# Altium schematic sheet hwcb_2.SchDoc
size C; SheetNumber: 2; SheetTotal: 2
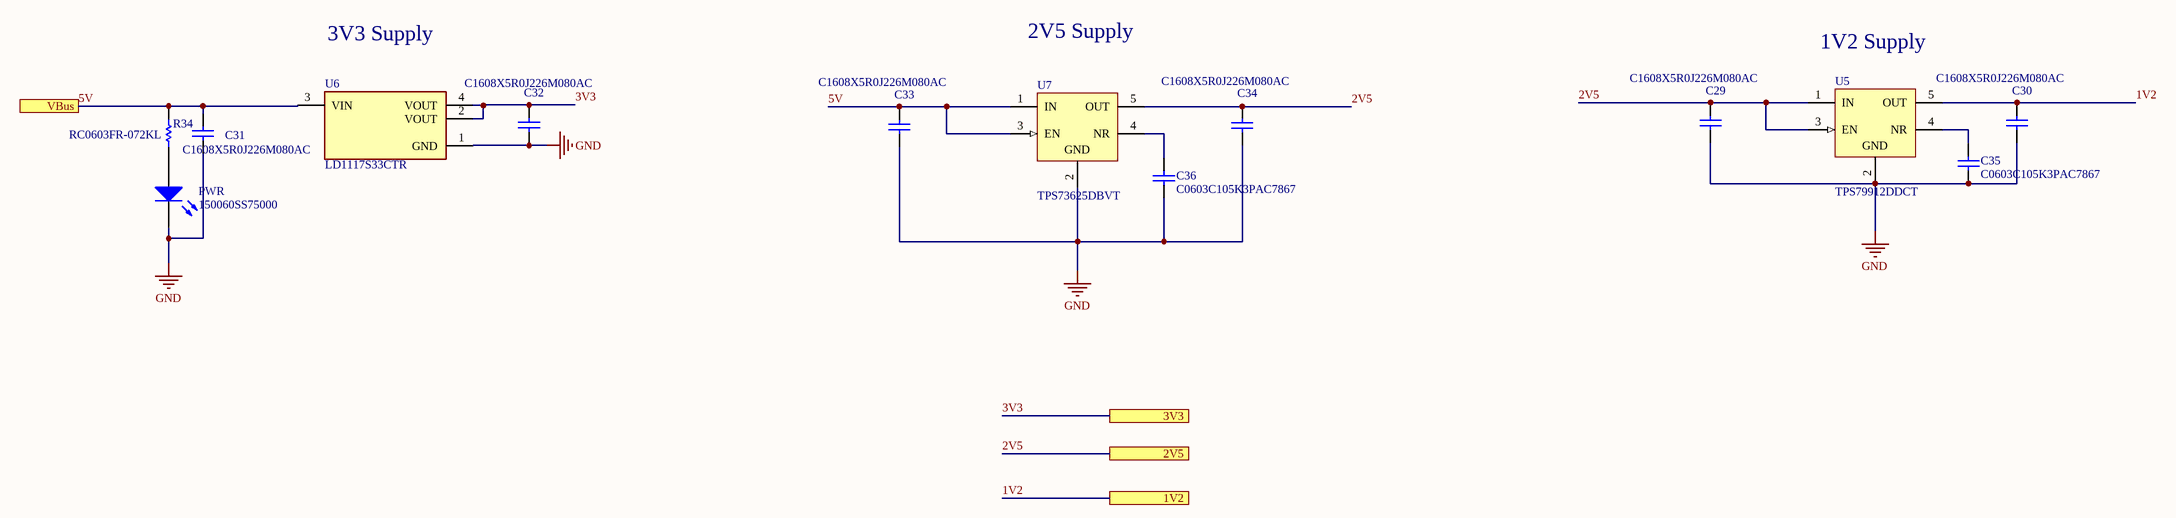
[diagram p0: hwcb_2.SchDoc]

## Parts
C29  C1608X5R0J226M080AC  [CAPC1608X100X20ML10]
C30  C1608X5R0J226M080AC  [CAPC1608X100X20ML10]
C31  C1608X5R0J226M080AC  [CAPC1608X100X20ML10]
C32  C1608X5R0J226M080AC  [CAPC1608X100X20ML10]
C33  C1608X5R0J226M080AC  [CAPC1608X100X20ML10]
C34  C1608X5R0J226M080AC  [CAPC1608X100X20ML10]
C35  C0603C105K3PAC7867  [CAPC1608X90X35LL15T15]
C36  C0603C105K3PAC7867  [CAPC1608X90X35LL15T15]
PWR  150060SS75000  [0603_A]
R34  RC0603FR-072KL  [RESC1608X55X25LL10T15]
U5  TPS79912DDCT  [DDC0005A_L]
U6  LD1117S33CTR  [FP-SOT-223-0046067_14-MFG]
U7  TPS73625DBVT  [DBV0005A_M]

## Ports
1V2, 2V5, 3V3, VBus

## Nets
GND: C29.1 C30.1 C31.1 C32.1 C33.1 C34.1 C35.2 C36.2 PWR.1(K) U5.2(GND) U6.1(GND) U7.2(GND)
1V2: C30.2 U5.5(OUT) ; port 1V2
2V5: C29.2 C34.2 U5.1(IN) U5.3(EN) U7.5(OUT) ; port 2V5
3V3: C32.2 U6.2(VOUT) U6.4(VOUT) ; port 3V3
5V: C31.2 C33.2 R34.1 U6.3(VIN) U7.1(IN) U7.3(EN) ; port VBus
NetC35_1: C35.1 U5.4(NR)
NetC36_1: C36.1 U7.4(NR)
NetPWR_2: PWR.2(A) R34.2

## Notes on the sheet
- 3V3 Supply
- 2V5 Supply
- (near U5) 1V2 Supply

## Library data of the parts
C29-C34 = CMP-2000-05440-1: Chip Capacitor, 22 uF, +/- 20%, 6.3 V, -55 to 85 degC, 1608 (0603 Metric), RoHS, Tape and Reel; PCN Part Number: MLCCPartNumberChange30/Nov/2012; Manufacturer: TDK; Temperature Coefficient: X5R; Product Training Modules: CSeriesGeneralApplicationsSEAT,CCV,andTVCLDesignToolsGuidetoReplacinganElectrolyticCapacitorwithanMLCC; Other Names: 445-8028-1; Capacitance: 22µF; Voltage - Rated: 6.3V; Design Resources: 20WNon-IsolatedBuckLEDDriverUsingPLLNK460KG; Online Catalog: CSeries,GeneralPurpose; Kits: 445-9003-KIT-ND-KITCAPCERHICAPMLCCSMD; Tolerance: ±20%; Series: C; Thickness (Max): 0.039"(1.00mm); Mounting Type: SurfaceMount,MLCC; Ratings: -; Datasheet Version: Mar-15; Package Reference: 603; Packaging: CutTape(CT); Features: -; Package / Case: 0603(1608Metric); Family: CeramicCapacitors; Lead Spacing: -; RoHS Information: RoHSCertificate-MLCC; Manufacturer URL: http://www.tdk.com/; Lead Style: -; Category: Capacitors; Applications: GeneralPurpose; Package Description: 2-Pin Surface Mount Device, Body 1.6 x 0.8 mm; Standard Package: 1; Datasheet URL: http://www.farnell.com/datasheets/1913358.pdf; Height - Seated (Max): -; Operating Temperature: -55degC~85degC; Size / Dimension: 0.063"Lx0.031"W(1.60mmx0.80mm)
C35 C36 = CMP-2006-02216-2: Manufacturer: Kemet; Part Number: C0603C105K3PAC7867
PWR = CMP-1426-00004-1: SMD mono-color Chip LED, WL-SMCW, Super Red; Manufacturer: Wuerth Elektronik; PartNumber: 150060SS75000; ComponentLink2URL: http://katalog.we-online.com/led/datasheet/150060SS75000.pdf; ComponentLink2Description: Datasheet; PackageReference: 0603_A; ComponentLink1Description: Manufacturer URL; ComponentLink1URL: http://www.we-online.com; Color: Super Red
R34 = CMP-2000-06937-1: Chip Resistor, 2 KOhm, +/- 1%, 50 V, -55 to 155 degC, 0603 (1608 Metric), RoHS, Tape and Reel; Manufacturer: Yageo; PCN Other: RC/AC0603/0805/120622/Jan/2013; Resistance (Ohms): 2k; Catalog Drawings: ThickFilmResistorTopThickFilmResistorSide; Kits: PHH4-KIT-ND-RESKIT1K-9.76K1/10W5700PCS; EDA / CAD Models: DownloadfromAcceleratedDesigns; HTML Datasheet: RCSeries,LSuffixDatasheet.html; Power (Watts): 0.1W,1/10W; Other Names: 311-2.00KHRCT; Temperature Coefficient: ±100ppm/°C; Online Catalog: RC0603Series; Features: MoistureResistant; Height: 0.022"(0.55mm); Size / Dimension: 0.063"Lx0.031"W(1.60mmx0.80mm); Product Training Modules: ChipResistor; Mounting Technology: SurfaceMount; Package / Case: 0603(1608Metric); Supplier Device Package: 0603; Category: Resistors; Tolerance: ±1%; Packaging: CutTape(CT); Operating Temperature: -55°C~155°C; Standard Package: 1; Series: RC; Datasheet URL: http://www.yageo.com/documents/recent/PYu-RC_Group_51_RoHS_L_7.pdf; Package Description: 2-Pin Surface Mount Device, Body 1.6 x 0.8 mm; Number of Terminations: 2; Datasheet Version: Rev. 7, 05/2017; Package Reference: 0603; Composition: ThickFilm; Manufacturer URL: http://www.yageo.com/; Family: ChipResistor-SurfaceMount
U5 = CMP-0394-01099-2: Single Output High PSRR LDO, 200 mA, Fixed 1.2 V Output, 2.7 to 6.5 V Input, with Low IQ, 5-pin SOT (DDC), -40 to 125 degC, Green (RoHS & no Sb/Br); Manufacturer: Texas Instruments; Iq(Typ)(mA): 0.04; Vin(Min)(V): 2.7; Rating: Catalog; Vdo(Typ)(mV): 100; Vin(Max)(V): 6.5; Iout(Max)(A): 0.2; Vout Adj(Min)(V): 1.2; SubFamily: Single Channel LDO; Accuracy(%): 2; Mounting Technology: Surface Mount; Eco-Plan: Green (RoHS & no Sb/Br); ComponentLink3URL: http://www.ti.com/litv/pdf/mpds123d; PartNumber: TPS79912DDCT; PackageReference: DDC0005A; ComponentLink3Description: Package Specification; Code_JEDEC: MO-193; PackageDescription: 5-Pin Plastic Small Outline, Body 2.9 x 1.6 mm, 0.95 mm Pitch; ComponentLink1Description: Manufacturer URL; ComponentLink1URL: http://www.ti.com/; DatasheetVersion: SBVS056J; ComponentLink2Description: Datasheet; PackageVersion: 4204403-2/E; ComponentLink2URL: http://www.ti.com/general/docs/lit/getliterature.tsp?genericPartNumber=TPS79912&fileType=pdf; Fixed Output Options(V): 1.2; Vout Adj(Max)(V): 1.2
U6 = CMP-0244-00307-2: IC REG LINEAR 3.3V 800MA SOT223; Input Bias Current: 5mA; Output Voltage Accuracy: 1%; Dropout Voltage: 1.1V; Power Dissipation: 12W; Polarity: Positive; Min Input Voltage: 5.3V; Quiescent Current: 10mA; Max Output Current: 1.3A; Output Current: 950mA; Number of Regulators: 1; Max Supply Voltage: 15V; Output Type: Fixed; Output Voltage: 3.3V; Number of Terminals: 4; Min Supply Voltage: 3.3V; Termination: SMD/SMT; Mount: Surface Mount; Max Power Dissipation: 12W; Case/Package: SOT-223; Lead Free: Lead Free; Height: 1.8mm; REACH SVHC: No SVHC; Radiation Hardening: No; Width: 3.5mm; Length: 6.5mm; Packaging: Tape and Reel; Max Input Voltage: 15V; Accuracy: 1%; Weight: 0.01lb; Contact Plating: Tin; Max Operating Temperature: 125°C; Number of Pins: 4; Max Output Voltage: 3.3V; Min Operating Temperature: -40°C; Nominal Output Voltage: 3.3V; Package Quantity: 1; Min Output Voltage: 3.3V; Number of Outputs: 1
U7 = CMP-0395-00283-2: Single Output Low Noise LDO, 400 mA, Fixed 2.5 V Output, 1.7 to 5.5 V Input, with Reverse Current Protection, 5-pin SOT-23 (DBV), -40 to 85 degC, Green (RoHS & no Sb/Br); Manufacturer: Texas Instruments; Iout(Max)(A): 0.4; Fixed Output Options(V): 2.5; Rating: Catalog; Vdo(Typ)(mV): 75; Vin(Min)(V): 1.7; Accuracy(%): 1; Vin(Max)(V): 5.5; SubFamily: Single Channel LDO; Iq(Typ)(mA): 0.3; ComponentLink2URL: http://www.ti.com/general/docs/lit/getliterature.tsp?genericPartNumber=TPS73625&fileType=pdf; Vout Adj(Min)(V): 2.5; Vout Adj(Max)(V): 2.5; PackageReference: DBV0005A; Code_JEDEC: MO-178; ComponentLink3Description: Package Specification; ComponentLink2Description: Datasheet; ComponentLink1Description: Manufacturer URL; PartNumber: TPS73625DBVT; PackageDescription: 5-Pin Plastic Small Outline, Body 1.60 Ãƒâ€” 2.90 mm, Pitch 0.95 mm; Mounting Technology: Surface Mount; ComponentLink4URL: Samples URL:http://www.ti.com/product/tps73625#samples; DatasheetVersion: SBVS038T; ComponentLink3URL: http://www.ti.com/litv/pdf/mpds018i; Eco-Plan: Green (RoHS & no Sb/Br); PackageVersion: 4073253-4/K; ComponentLink4Description: URL Link1; ComponentLink1URL: http://www.ti.com/